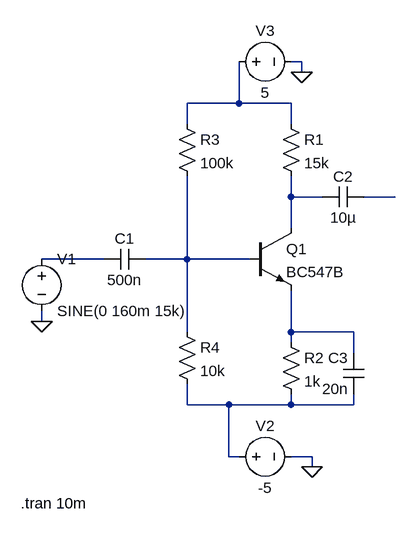
[diagram p0: schematic GAIN.asc]
GAIN.asc, the LTspice schematic file:
Version 4.1
SHEET 1 880 680
WIRE 320 -128 304 -128
WIRE 320 -112 320 -128
WIRE 224 -64 224 -128
WIRE 224 -64 144 -64
WIRE 304 -64 224 -64
WIRE 144 -32 144 -64
WIRE 304 -32 304 -64
WIRE 304 80 304 48
WIRE 352 80 304 80
WIRE 464 80 416 80
WIRE 304 128 304 80
WIRE 16 176 -80 176
WIRE 144 176 144 48
WIRE 144 176 80 176
WIRE 240 176 144 176
WIRE -80 272 -80 256
WIRE 144 288 144 176
WIRE 304 288 304 224
WIRE 400 288 304 288
WIRE 304 304 304 288
WIRE 400 320 400 288
WIRE 144 400 144 368
WIRE 208 400 144 400
WIRE 304 400 304 384
WIRE 304 400 208 400
WIRE 400 400 400 384
WIRE 400 400 304 400
WIRE 208 480 208 400
WIRE 224 480 208 480
WIRE 336 480 304 480
WIRE 336 496 336 480
FLAG -80 272 0
FLAG 320 -112 0
FLAG 336 496 0
SYMBOL npn 240 128 R0
SYMATTR InstName Q1
SYMATTR Value BC547B
SYMBOL res 288 -48 R0
SYMATTR InstName R1
SYMATTR Value 15k
SYMBOL res 288 288 R0
SYMATTR InstName R2
SYMATTR Value 1k
SYMBOL res 128 -48 R0
SYMATTR InstName R3
SYMATTR Value 100k
SYMBOL res 128 272 R0
SYMATTR InstName R4
SYMATTR Value 10k
SYMBOL cap 80 160 R90
WINDOW 0 0 32 VBottom 2
WINDOW 3 32 32 VTop 2
SYMATTR InstName C1
SYMATTR Value 500n
SYMBOL cap 416 64 R90
WINDOW 0 0 32 VBottom 2
WINDOW 3 32 32 VTop 2
SYMATTR InstName C2
SYMATTR Value 10µ
SYMBOL cap 416 384 R180
WINDOW 0 24 56 Left 2
WINDOW 3 24 8 Left 2
SYMATTR InstName C3
SYMATTR Value 20n
SYMBOL voltage -80 160 R0
WINDOW 123 0 0 Left 0
WINDOW 39 0 0 Left 0
SYMATTR InstName V1
SYMATTR Value SINE(0 160m 15k)
SYMBOL voltage 208 480 R270
WINDOW 0 32 56 VTop 2
WINDOW 3 -32 56 VBottom 2
WINDOW 123 0 0 Left 0
WINDOW 39 0 0 Left 0
SYMATTR InstName V2
SYMATTR Value -5
SYMBOL voltage 208 -128 R270
WINDOW 0 32 56 VTop 2
WINDOW 3 -32 56 VBottom 2
WINDOW 123 0 0 Left 0
WINDOW 39 0 0 Left 0
SYMATTR InstName V3
SYMATTR Value 5
TEXT -112 552 Left 2 !.tran 10m

The netlist it stands for:
* GAIN.asc
Q1 N002 N005 N006 0 BC547B
R1 N001 N002 15k
R2 N006 N007 1k
R3 N001 N005 100k
R4 N005 N007 10k
C1 N005 N004 500n
C2 N003 N002 10µ
C3 N007 N006 20n
V1 N004 0 SINE(0 160m 15k)
V2 N007 0 -5
V3 N001 0 5
.model NPN NPN
.model PNP PNP
.lib standard.bjt
.tran 10m
.backanno
.end